# EasyEDA Pro project P1.eprj, schematic 2021电赛F题国一作品

## Sheets
1 main
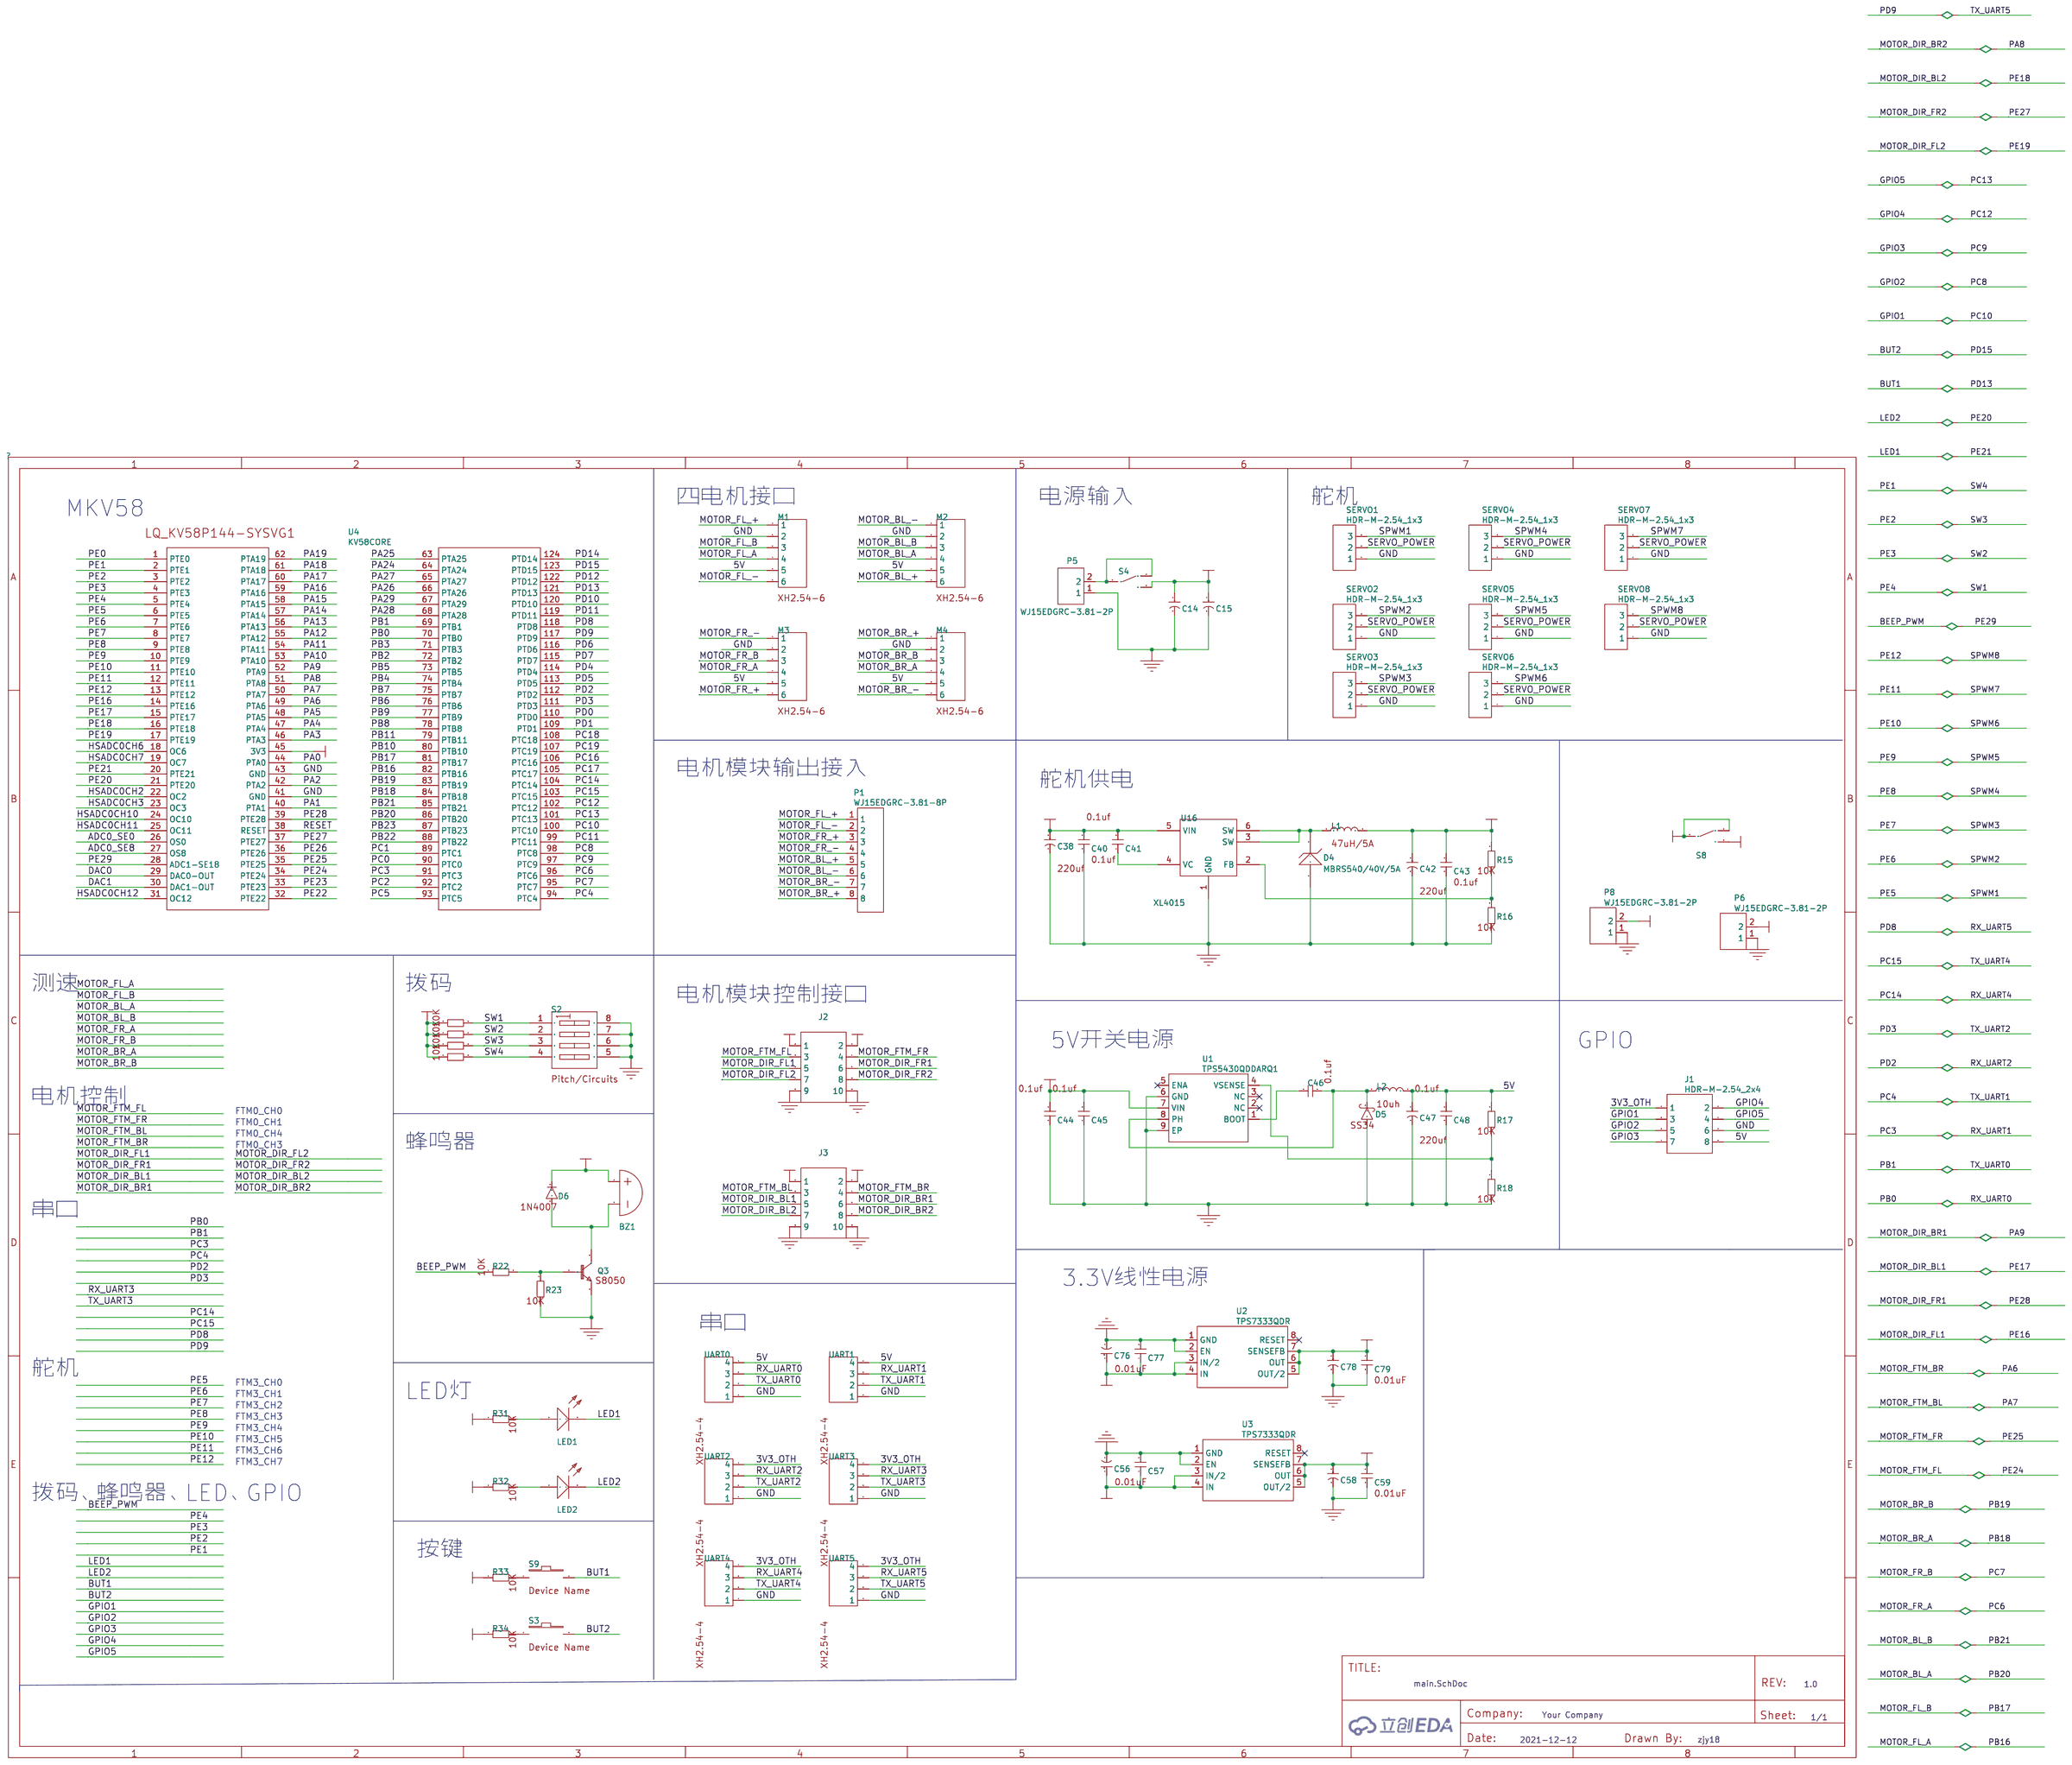
[diagram p0: main]
2 BTN7960 copy
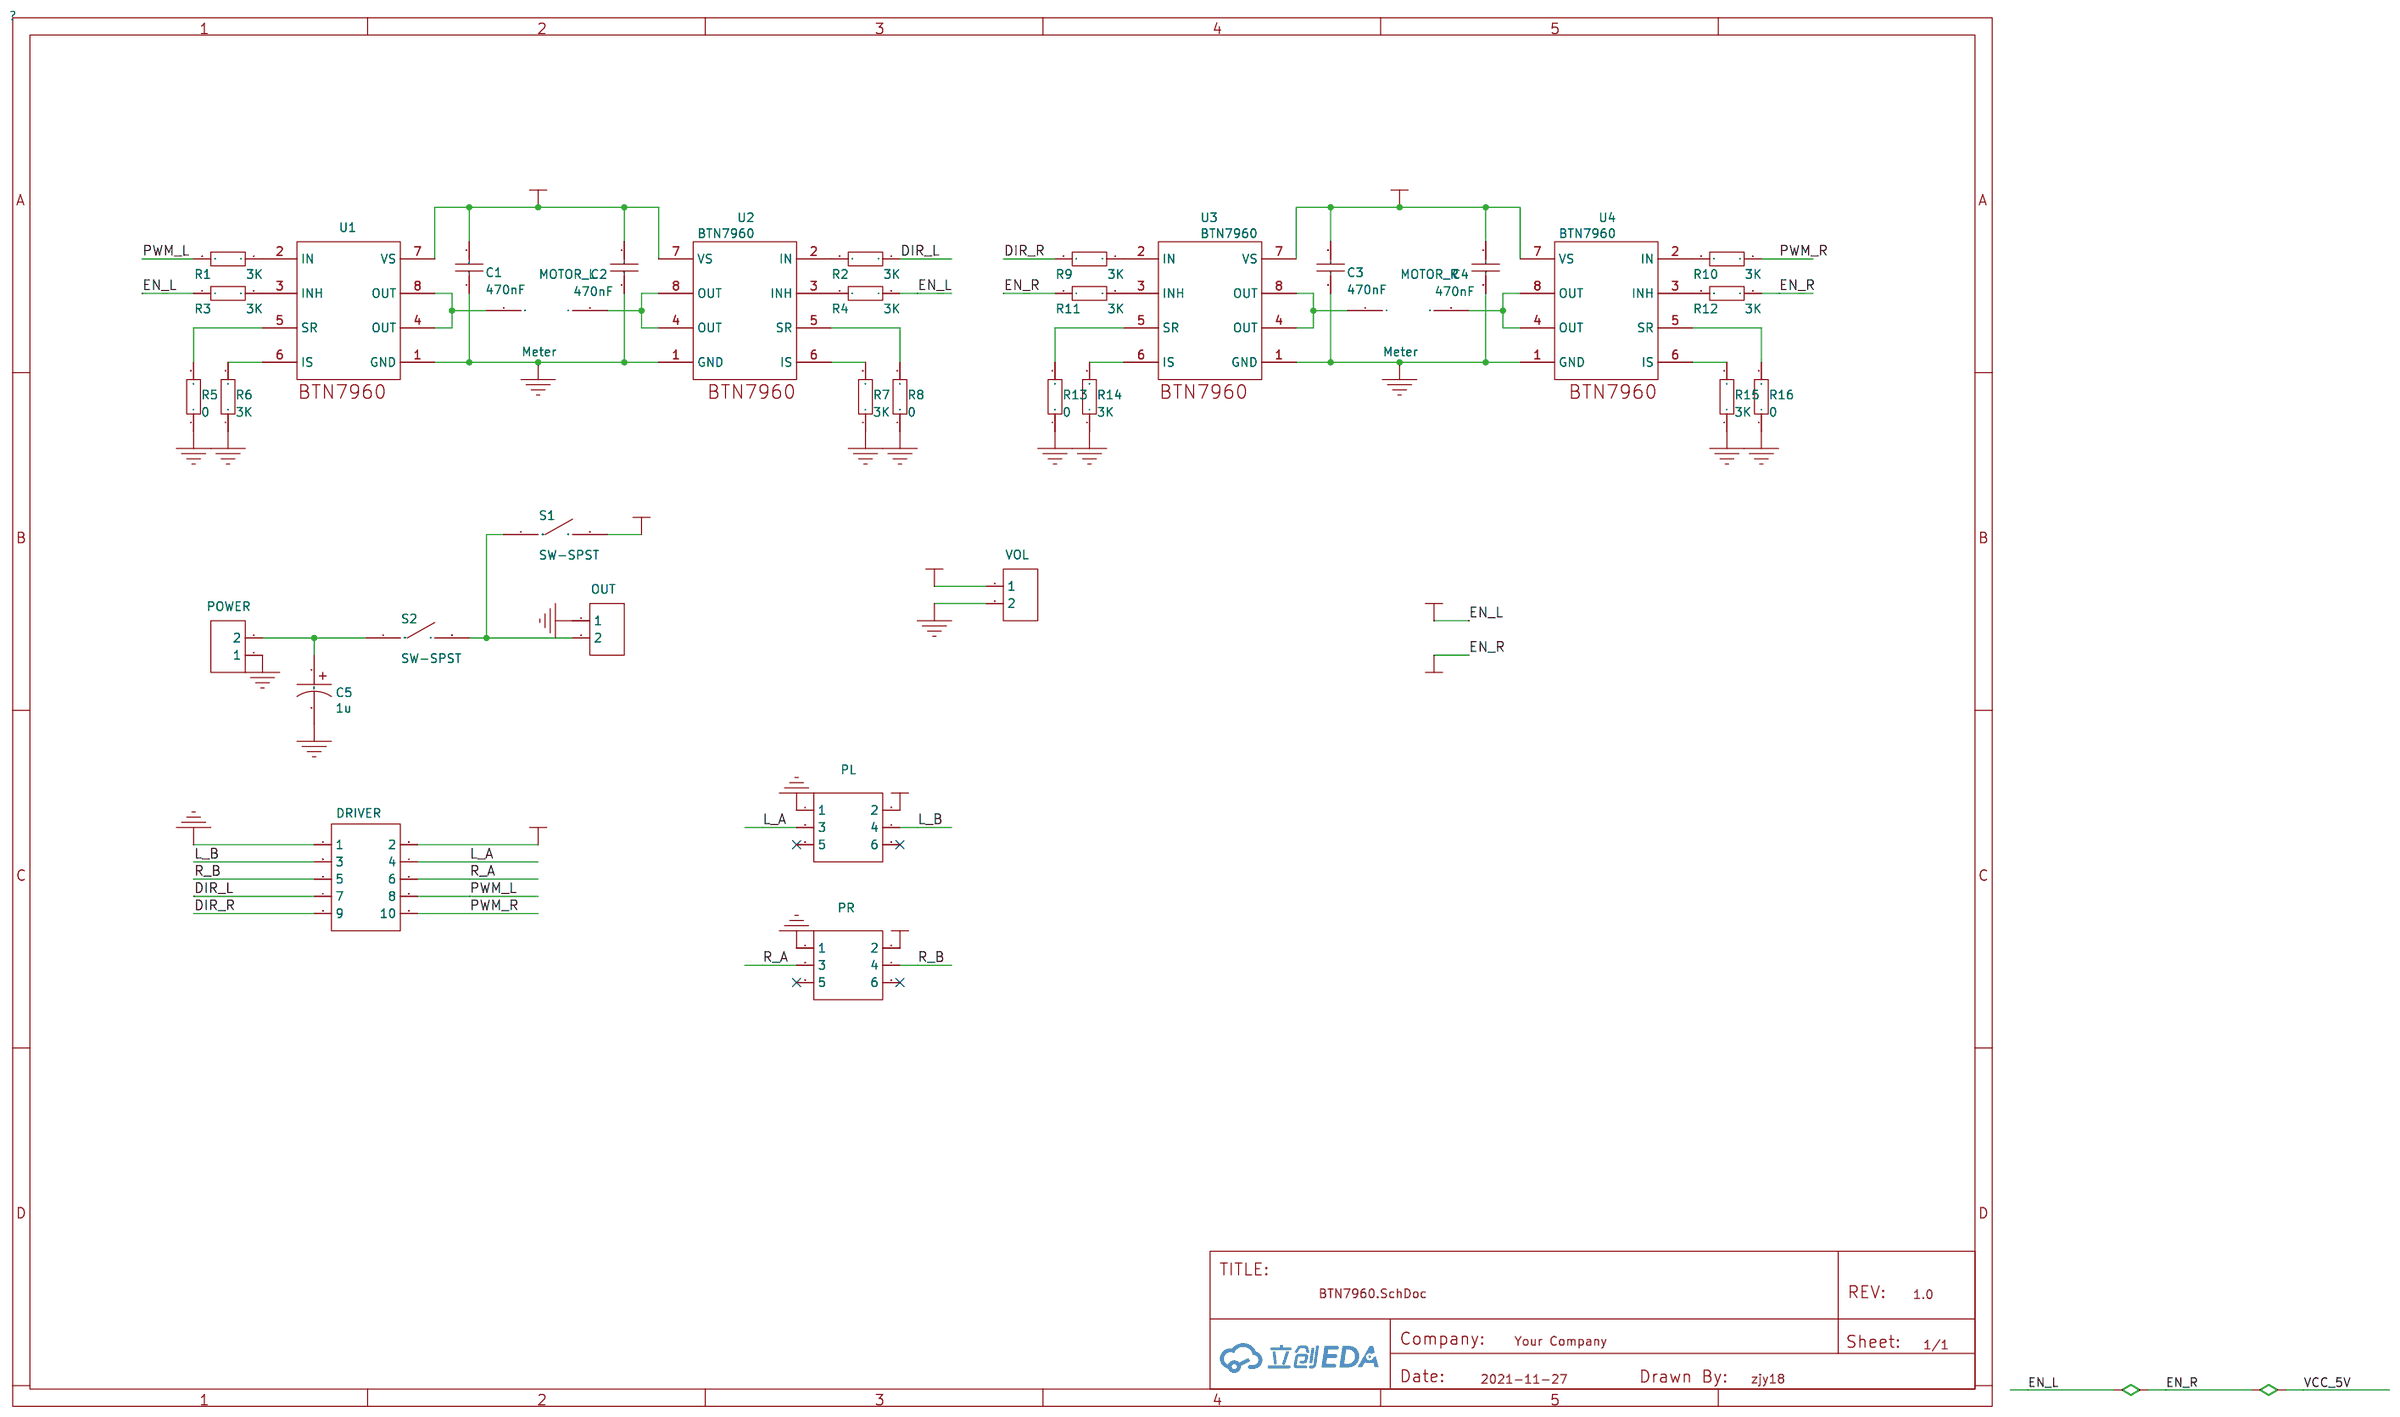
[diagram p1: BTN7960 copy]

## Parts
sheet BTN7960 copy
C1  470nF
C2  470nF
C3  470nF
C4  470nF
C5  1u
DRIVER  HDR-M-2.54_2x5
MOTOR_L  Meter
MOTOR_R  Meter
OUT  HDR-F-2.54_1x2
PL  HDR-M-2.54_2x3
POWER  HDR-F-2.54_1x2
PR  HDR-M-2.54_2x3
R1  3K
R2  3K
R3  3K
R4  3K
R5  0
R6  3K
R7  3K
R8  0
R9  3K
R10  3K
R11  3K
R12  3K
R13  0
R14  3K
R15#2  3K
R16#2  0
S1  SW-SPST
S2#2  SW-SPST
U1#2  New_Symbol
U2#2  BTN7960
U3#2  BTN7960
U4#2  BTN7960
VOL  HDR-F-2.54_1x2
sheet main
BZ1  Device Name
C14  Device Name
C15  Device Name
C38  NO
C40  xxuF/xxV/Footprint
C41  xxuF/xxV/Footprint
C42  NO
C43  xxuF/xxV/Footprint
C44  xxuF/xxV/Footprint
C45  xxuF/xxV/Footprint
C46  xxuF/xxV/Footprint
C47  NO
C48  xxuF/xxV/Footprint
C56  Device Name
C57  Device Name
C58  Device Name
C59  Device Name
C76  Device Name
C77  Device Name
C78  Device Name
C79  Device Name
D4  MBRS540/40V/5A
D5  Device Name
D6  Device Name
J1  HDR-M-2.54_2x4
J2  HDR-M-2.54_2x5
J3  HDR-M-2.54_2x5
L1  Device Name
L2  Device Name
LED1  直插LED
LED2  直插LED
M1  XH2.54-6
M2  XH2.54-6
M3  XH2.54-6
M4  XH2.54-6
P1  WJ15EDGRC-3.81-8P
P5  WJ15EDGRC-3.81-2P
P6  WJ15EDGRC-3.81-2P
P8  WJ15EDGRC-3.81-2P
Q3  Device Name
R15  xxR/Precision/Footprint
R16  xxR/Precision/Footprint
R17  xxR/Precision/Footprint
R18  xxR/Precision/Footprint
R22  xxR/Precision/Footprint
R23  xxR/Precision/Footprint
R31  xxR/Precision/Footprint
R32  xxR/Precision/Footprint
R33  xxR/Precision/Footprint
R34  xxR/Precision/Footprint
R100  xxR/Precision/Footprint
R101  xxR/Precision/Footprint
R102  xxR/Precision/Footprint
R103  xxR/Precision/Footprint
S2  Device Name
S3  Device Name
S4  Device Name
S8  Device Name
S9  Device Name
SERVO1  HDR-M-2.54_1x3
SERVO2  HDR-M-2.54_1x3
SERVO3  HDR-M-2.54_1x3
SERVO4  HDR-M-2.54_1x3
SERVO5  HDR-M-2.54_1x3
SERVO6  HDR-M-2.54_1x3
SERVO7  HDR-M-2.54_1x3
SERVO8  HDR-M-2.54_1x3
U1  TPS5430QDDARQ1
U2  TPS7333QDR
U3  TPS7333QDR
U4  KV58CORE
U16  XL4015
UART0  XH2.54-4
UART1  XH2.54-4
UART2  XH2.54-4
UART3  XH2.54-4
UART4  XH2.54-4
UART5  XH2.54-4

## Library data of the parts
C1-C4 = 470nF: Published: 8-Jun-2000; LatestRevisionDate: 17-Jul-2002; LatestRevisionNote: Re-released for DXP Platform.; PackageReference: RAD-0.3; Publisher: Altium Limited; Comment: Cap
C5 = 1u
DRIVER J2 J3 = HDR-M-2.54_2x5: Supplier Part: C178292; Supplier: LCSC
MOTOR_L MOTOR_R = Meter: Published: 24-Mar-1999; LatestRevisionDate: 17-Jul-2002; LatestRevisionNote: Re-released for DXP Platform.; PackageReference: RAD-0.1; Publisher: Altium Limited; Note: Place a "letter" into the symbol to show the function of the meter or instrument
OUT POWER VOL = HDR-F-2.54_1x2: Supplier Part: C49661; Supplier: LCSC
PL PR = HDR-M-2.54_2x3: Supplier Part: C65114; Supplier: LCSC
R1-R4 R6 R7 R9-R12 R14 R15#2 = 3K: Published: 8-Jun-2000; LatestRevisionDate: 17-Jul-2002; LatestRevisionNote: Re-released for DXP Platform.; PackageReference: AXIAL-0.4; Publisher: Altium Limited; Comment: Res2
R5 R8 R13 R16#2 = 0: Published: 8-Jun-2000; LatestRevisionDate: 17-Jul-2002; LatestRevisionNote: Re-released for DXP Platform.; PackageReference: AXIAL-0.4; Publisher: Altium Limited; Comment: Res2
S1 S2#2 = SW-SPST: Published: 24-Mar-1999; LatestRevisionDate: 17-Jul-2002; LatestRevisionNote: Re-released for DXP Platform.; PackageReference: SPST-2; Publisher: Altium Limited; PackageDescription: Switch; 2 Leads
U1#2 = New_Symbol
U2#2 U3#2 U4#2 = BTN7960
BZ1 S3 S4 S8 S9 = Device Name
C14 C15 = Device Name: Sch Name: xxuF/xxV
C38 C42 = NO: Manufacture: Device Name; Sch Name: 220uf
C40 C41 C43 C45 C48 = xxuF/xxV/Footprint: Sch Name: 0.1uf
C44 = xxuF/xxV/Footprint: Sch Name: 4.7uf
C46 = xxuF/xxV/Footprint: Sch Name: 10nf
C47 = NO: Manufacture: Device Name; Sch Name: 100uf
C56 C58 C76 C78 = Device Name: Sch Name: 100uF
C57 C59 C77 C79 = Device Name: Sch Name: 0.01uF
D4 = MBRS540/40V/5A: Published: 8-Jun-2000; LatestRevisionDate: 17-Jul-2002; LatestRevisionNote: Re-released for DXP Platform.; PackageReference: DIODE-0.7; Publisher: Altium Limited
D5 = Device Name: Sch Name: SS34
D6 = Device Name: Sch Name: 1N4007
J1 = HDR-M-2.54_2x4: Supplier Part: C58363; Supplier: LCSC
L1 = Device Name: Sch Name: 47uH/5A
L2 = Device Name: Sch Name: 10uh
LED1 LED2 = 直插LED
M1-M4 = XH2.54-6
P1 = WJ15EDGRC-3.81-8P: Supplier: LCSC; Manufacturer: ReliaPro; Supplier Part: C14235; JLCPCB Part Class: Extended Part
P5 P6 P8 = WJ15EDGRC-3.81-2P: Supplier: LCSC; Manufacturer: ReliaPro; Supplier Part: C8387; JLCPCB Part Class: Extended Part
Q3 = Device Name: Sch Name: S8050
R15 = xxR/Precision/Footprint: Sch Name: 11.5K
R16 = xxR/Precision/Footprint: Sch Name: 3.3K
R17 R23 R31-R34 = xxR/Precision/Footprint: Sch Name: 10K
R18 = xxR/Precision/Footprint: Sch Name: 3.24K
R22 R100-R103 = xxR/Precision/Footprint: Sch Name: 510R
S2 = Device Name: Sch Name: Pitch/Circuits
SERVO1-SERVO8 = HDR-M-2.54_1x3: Supplier Part: C180248; Supplier: LCSC
U1 = TPS5430QDDARQ1: Supplier: LCSC; Supplier Part: C388178; Manufacturer: Texas Instruments; JLCPCB Part Class: Extended Part
U2 U3 = TPS7333QDR: Supplier: LCSC; Manufacturer: TI; Supplier Part: C23791; JLCPCB Part Class: Extended Part
U4 = KV58CORE
U16 = XL4015
UART0-UART5 = XH2.54-4

## Nets
3V3: C58.1 C59.1 U3.5(OUT/2) U3.6(OUT) U3.7(SENSEFB) U4.45(3V3)
3V3_OTH: C78.1 C79.1 J1.1 R31.2 R32.2 R33.2 R34.2 R100.1 R101.1 R102.1 R103.1 U2.5(OUT/2) U2.6(OUT) U2.7(SENSEFB) UART2.4 UART3.4 UART4.4 UART5.4
5V: BZ1.1 C47.1 C48.2 C56.1 C57.1 C76.1 C77.1 D6.2(C) J1.8 J2.1 J2.2 J3.1 J3.2 L2.2 M1.5 M2.5 M3.5 M4.5 R17.2 U2.3(IN/2) U2.4(IN) U3.3(IN/2) U3.4(IN) UART0.4 UART1.4
GND: C1.1 C2.2 C3.1 C4.2 C5.2 C14.2 C15.2 C38.2 C40.2 C42.2 C43.2 C44.1 C45.1 C47.2 C48.1 C56.2 C57.2 C58.2 C59.2 C76.2 C77.2 C78.2 C79.2 D4.1(A) D5.1(A) DRIVER.1 J1.6 J2.9 J2.10 J3.9 J3.10 M1.2 M2.2 M3.2 M4.2 OUT.1 P5.1 P6.1 P8.1 PL.1 POWER.1 PR.1 Q3.2(e) R5.1 R6.1 R7.1 R8.1 R13.1 R14.1 R15#2.1 R16.1 R16#2.1 R18.1 R23.1 S2.5(B4) S2.6(B3) S2.7(B2) S2.8(B1) SERVO1.1 SERVO2.1 SERVO3.1 SERVO4.1 SERVO5.1 SERVO6.1 SERVO7.1 SERVO8.1 U1.6(GND) U1.9(EP) U1#2.1(GND) U2.1(GND) U2.2(EN) U2#2.1(GND) U3.1(GND) U3.2(EN) U3#2.1(GND) U4.41(GND) U4.43(GND) U4#2.1(GND) U16.1(GND) UART0.1 UART1.1 UART2.1 UART3.1 UART4.1 UART5.1 VOL.2
VCC: P6.2 P8.2 S8.3(NC)
VCC_5V: DRIVER.2 PL.2 PR.2 R3.1 R4.1 R11.1 R12.1
VIN: C14.1 C15.1 C38.1 C40.1 C41.2 C44.2 C45.2 S4.3(NC) S8.1(NO) S8.2(COMMON) U1.7(VIN) U16.5(VIN)
ADC0_SE0: U4.26(OS0)
ADC0_SE8: U4.27(OS8)
BATTERY: C1.2 C2.1 C3.2 C4.1 S1.2(NO) U1#2.7(VS) U2#2.7(VS) U3#2.7(VS) U4#2.7(VS) VOL.1
BEEP_PWM: R22.1 U4.28(ADC1-SE18)
BUT1: S9.2 U4.121(PTD13)
BUT2: S3.2 U4.123(PTD15)
DAC0: U4.29(DAC0-OUT)
DAC1: U4.30(DAC1-OUT)
DIR_L: DRIVER.7 R2.1
DIR_R: DRIVER.9 R9.2
GPIO1: J1.3 U4.100(PTC10)
GPIO2: J1.5 U4.98(PTC8)
GPIO3: J1.7 U4.97(PTC9)
GPIO4: J1.2 U4.102(PTC12)
GPIO5: J1.4 U4.101(PTC13)
HSADC0CH2: U4.22(OC2)
HSADC0CH3: U4.23(OC3)
HSADC0CH6: U4.18(OC6)
HSADC0CH7: U4.19(OC7)
HSADC0CH10: U4.24(OC10)
HSADC0CH11: U4.25(OC11)
HSADC0CH12: U4.31(OC12)
L_A: DRIVER.4 PL.3
L_B: DRIVER.3 PL.4
LED1: LED1.2(K) U4.20(PTE21)
LED2: LED2.2(K) U4.21(PTE20)
MOTOR_BL_+: M2.6 P1.5
MOTOR_BL_-: M2.1 P1.6
MOTOR_BL_A: M2.4 U4.86(PTB20)
MOTOR_BL_B: M2.3 U4.85(PTB21)
MOTOR_BR_+: M4.1 P1.8
MOTOR_BR_-: M4.6 P1.7
MOTOR_BR_A: M4.4 U4.84(PTB18)
MOTOR_BR_B: M4.3 U4.83(PTB19)
MOTOR_DIR_BL1: J3.5 U4.15(PTE17)
MOTOR_DIR_BL2: J3.7 U4.16(PTE18)
MOTOR_DIR_BR1: J3.6 U4.52(PTA9)
MOTOR_DIR_BR2: J3.8 U4.51(PTA8)
MOTOR_DIR_FL1: J2.5 U4.14(PTE16)
MOTOR_DIR_FL2: J2.7 U4.17(PTE19)
MOTOR_DIR_FR1: J2.6 U4.39(PTE28)
MOTOR_DIR_FR2: J2.8 U4.37(PTE27)
MOTOR_FL_+: M1.1 P1.1
MOTOR_FL_-: M1.6 P1.2
MOTOR_FL_A: M1.4 U4.82(PTB16)
MOTOR_FL_B: M1.3 U4.81(PTB17)
MOTOR_FR_+: M3.6 P1.3
MOTOR_FR_-: M3.1 P1.4
MOTOR_FR_A: M3.4 U4.96(PTC6)
MOTOR_FR_B: M3.3 U4.95(PTC7)
MOTOR_FTM_BL: J3.3 U4.50(PTA7)
MOTOR_FTM_BR: J3.4 U4.49(PTA6)
MOTOR_FTM_FL: J2.3 U4.34(PTE24)
MOTOR_FTM_FR: J2.4 U4.35(PTE25)
PA0: U4.44(PTA0)
PA1: U4.40(PTA1)
PA2: U4.42(PTA2)
PA3: U4.46(PTA3)
PA4: U4.47(PTA4)
PA5: U4.48(PTA5)
PA10: U4.53(PTA10)
PA11: U4.54(PTA11)
PA12: U4.55(PTA12)
PA13: U4.56(PTA13)
PA14: U4.57(PTA14)
PA15: U4.58(PTA15)
PA16: U4.59(PTA16)
PA17: U4.60(PTA17)
PA18: U4.61(PTA18)
PA19: U4.62(PTA19)
PA24: U4.64(PTA24)
PA25: U4.63(PTA25)
PA26: U4.66(PTA26)
PA27: U4.65(PTA27)
PA28: U4.68(PTA28)
PA29: U4.67(PTA29)
PB0: U4.70(PTB0) UART0.3
PB1: U4.69(PTB1) UART0.2
PB2: U4.72(PTB2)
PB3: U4.71(PTB3)
PB4: U4.74(PTB4)
PB5: U4.73(PTB5)
PB6: U4.76(PTB6)
PB7: U4.75(PTB7)
PB8: U4.78(PTB8)
PB9: U4.77(PTB9)
PB10: U4.80(PTB10)
PB11: U4.79(PTB11)
PB22: U4.88(PTB22)
PB23: U4.87(PTB23)
PC0: U4.90(PTC0)
PC1: U4.89(PTC1)
PC2: U4.92(PTC2)
PC3: U4.91(PTC3) UART1.3
PC4: U4.94(PTC4) UART1.2
PC5: U4.93(PTC5)
PC11: U4.99(PTC11)
PC14: U4.104(PTC14) UART4.3
PC15: U4.103(PTC15) UART4.2
PC16: U4.106(PTC16)
PC17: U4.105(PTC17)
PC18: U4.108(PTC18)
PC19: U4.107(PTC19)
PD0: U4.110(PTD0)
PD1: U4.109(PTD1)
PD2: U4.112(PTD2) UART2.3
PD3: U4.111(PTD3) UART2.2
PD4: U4.114(PTD4)
PD5: U4.113(PTD5)
PD6: U4.116(PTD6)
PD7: U4.115(PTD7)
PD8: U4.118(PTD8) UART5.3
PD9: U4.117(PTD9) UART5.2
PD10: U4.120(PTD10)
PD11: U4.119(PTD11)
PD12: U4.122(PTD12)
PD14: U4.124(PTD14)
PE0: U4.1(PTE0)
PE1: R103.2 S2.4(A4) U4.2(PTE1)
PE2: R102.2 S2.3(A3) U4.3(PTE2)
PE3: R101.2 S2.2(A2) U4.4(PTE3)
PE4: R100.2 S2.1(A1) U4.5(PTE4)
PE5: SERVO1.3 U4.6(PTE5)
PE6: SERVO2.3 U4.7(PTE6)
PE7: SERVO3.3 U4.8(PTE7)
PE8: SERVO4.3 U4.9(PTE8)
PE9: SERVO5.3 U4.10(PTE9)
PE10: SERVO6.3 U4.11(PTE10)
PE11: SERVO7.3 U4.12(PTE11)
PE12: SERVO8.3 U4.13(PTE12)
PE22: U4.32(PTE22)
PE23: U4.33(PTE23)
PE26: U4.36(PTE26)
PWM_L: DRIVER.8 R1.2
PWM_R: DRIVER.10 R10.1
R_A: DRIVER.6 PR.3
R_B: DRIVER.5 PR.4
RESET: U4.38(RESET)
RX_UART3: UART3.3
SERVO_POWER: C42.1 C43.1 L1.2 R15.2 SERVO1.2 SERVO2.2 SERVO3.2 SERVO4.2 SERVO5.2 SERVO6.2 SERVO7.2 SERVO8.2
TX_UART3: UART3.2
Net-(C5-1): C5.1 POWER.2 S2#2.1(COMMON)
Net-(C46-1): C46.1 U1.1(BOOT)
Net-(C46-2): C46.2 D5.2(B) L2.1 U1.8(PH)
Net-(MOTOR_L-1): MOTOR_L.1 U1#2.4(OUT) U1#2.8(OUT)
Net-(MOTOR_L-2): MOTOR_L.2 U2#2.4(OUT) U2#2.8(OUT)
Net-(MOTOR_R-1): MOTOR_R.1 U3#2.4(OUT) U3#2.8(OUT)
Net-(MOTOR_R-2): MOTOR_R.2 U4#2.4(OUT) U4#2.8(OUT)
Net-(OUT-2): OUT.2 S1.1(COMMON) S2#2.2(NO)
Net-(R1-1): R1.1 U1#2.2(IN)
Net-(R2-2): R2.2 U2#2.2(IN)
Net-(R3-2): R3.2 U1#2.3(INH)
Net-(R4-2): R4.2 U2#2.3(INH)
Net-(R5-2): R5.2 U1#2.5(SR)
Net-(R6-2): R6.2 U1#2.6(IS)
Net-(R7-2): R7.2 U2#2.6(IS)
Net-(R8-2): R8.2 U2#2.5(SR)
Net-(R9-1): R9.1 U3#2.2(IN)
Net-(R10-2): R10.2 U4#2.2(IN)
Net-(R11-2): R11.2 U3#2.3(INH)
Net-(R12-2): R12.2 U4#2.3(INH)
Net-(R13-2): R13.2 U3#2.5(SR)
Net-(R14-2): R14.2 U3#2.6(IS)
Net-(R15#2-2): R15#2.2 U4#2.6(IS)
Net-(R16#2-2): R16#2.2 U4#2.5(SR)
Net-(R17-1): R17.1 R18.2 U1.4(VSENSE)
NETBZ1_2: BZ1.2 D6.1(A) Q3.3(c)
NETC41_1: C41.1 U16.4(VC)
NETD4_2: D4.2(K) L1.1 U16.3(SW) U16.6(SW)
NETLED1_1: LED1.1(A) R31.1
NETLED2_1: LED2.1(A) R32.1
NETP5_2: P5.2 S4.1(NO) S4.2(COMMON)
NETQ3_1: Q3.1(b) R22.2 R23.2
NETR15_1: R15.1 R16.2 U16.2(FB)
NETR33_1: R33.1 S9.1
NETR34_1: R34.1 S3.1

Not connected (* = marked no-connect by the designer): PL 5* 6*; PR 5* 6*; U1 2(NC)* 3(NC)* 5(ENA)*; U2 8(RESET)*; U3 8(RESET)*

## Notes on the sheets
sheet 1
- MKV58
- 四电机接口
- 电源输入
- 舵机
- 电机模块输出接入
- 舵机供电
- 测速
- 拨码
- 电机模块控制接口
- 5V开关电源
- GPIO
- 电机控制
- FTM0_CH0
- FTM0_CH1
- FTM0_CH4
- FTM0_CH3
- 蜂鸣器
- 串口
- 3.3V线性电源
- 串口
- 舵机
- FTM3_CH0
- FTM3_CH1
- FTM3_CH2
- LED灯
- FTM3_CH3
- FTM3_CH4
- FTM3_CH5
- FTM3_CH6
- FTM3_CH7
- 拨码、蜂鸣器、LED、GPIO
- 按键
